# Altium schematic sheet 17_网口接口.schdoc.schdoc
size 309 x 223 mm; Symbol: Sheet-Symbol_A4; Device: Sheet-Symbol_A4; Company: 嘉立创EDA; Version: V1.0; Page Size: A4; @Project Name: RK3568底板_V1.2; @Page Count: 6; @Update Date: 2024-05-10; @Create Date: 2024-04-18; @Schematic Name: 原理图; @Page No: 5; @Page Name: 网口接口
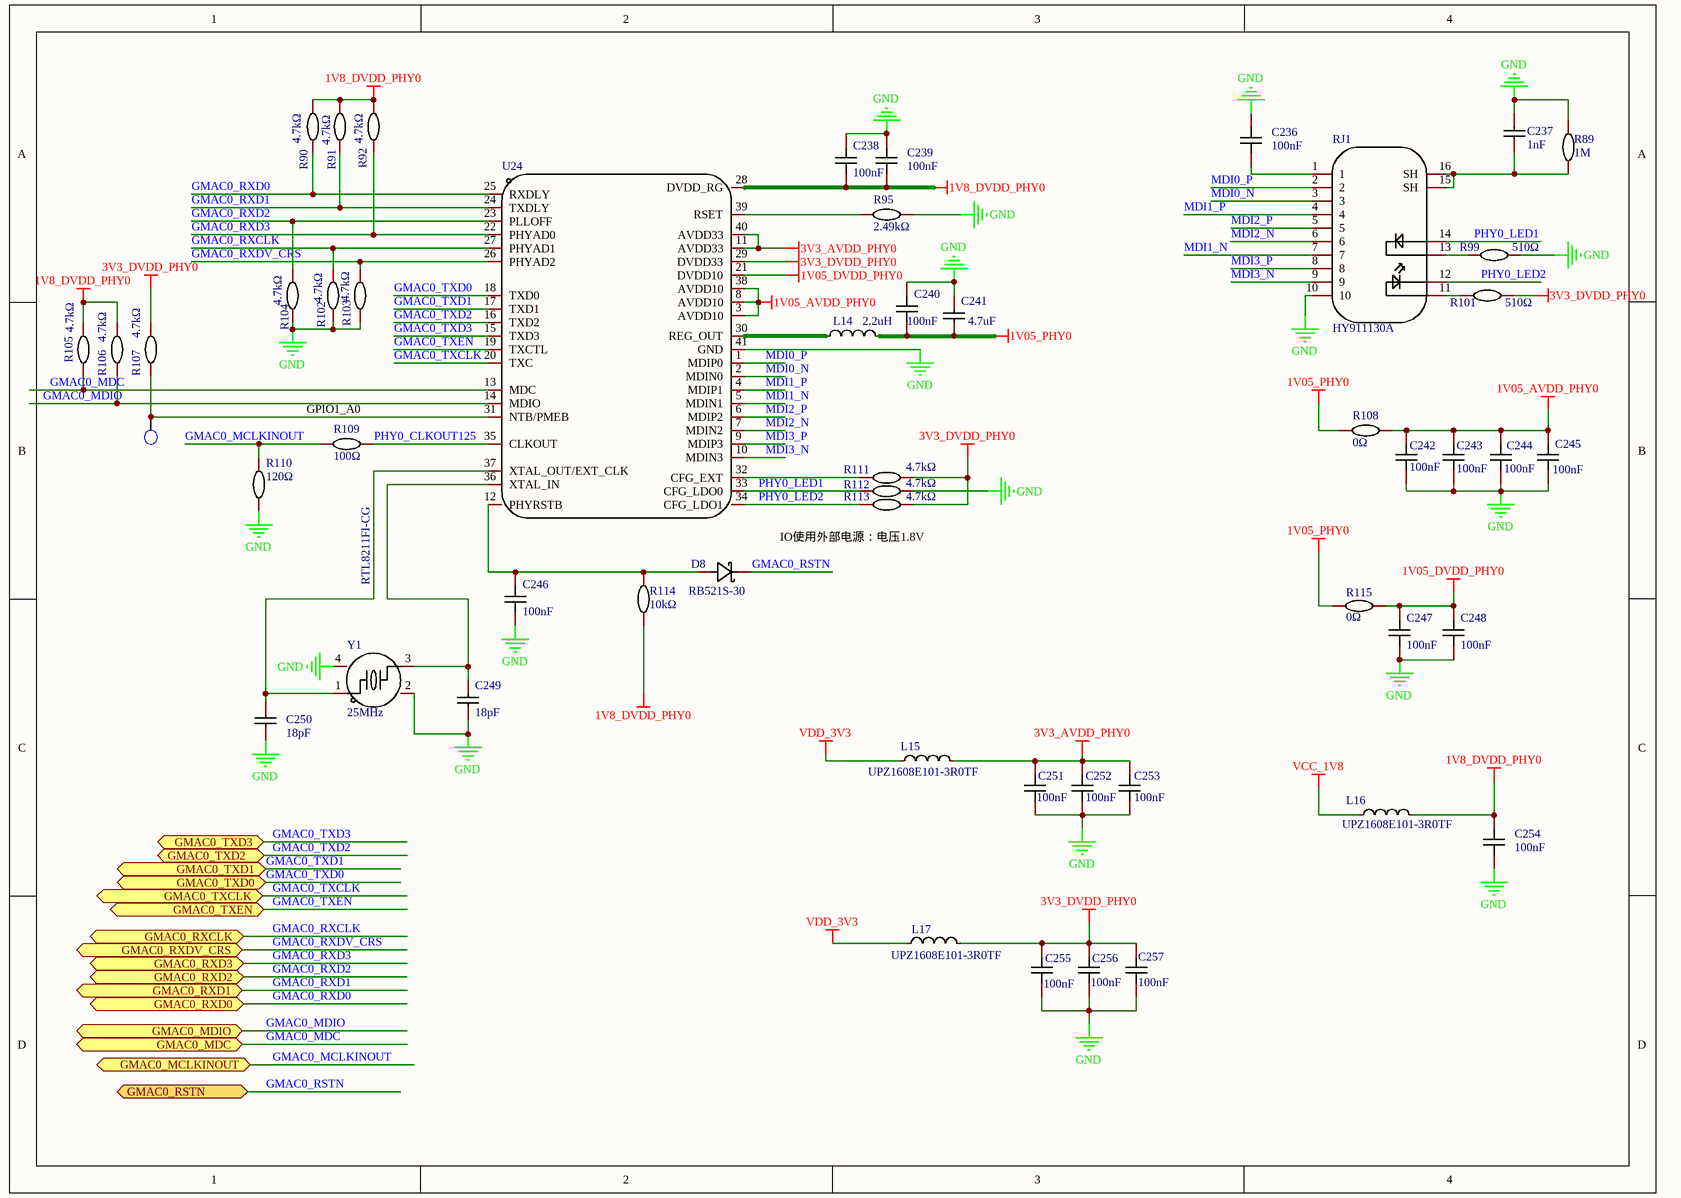
[diagram p0: 17_网口接口.schdoc.schdoc]

## Parts
C236  100nF  [C0603]
C237  1nF  [C0603]
C238  100nF  [C0603]
C239  100nF  [C0603]
C240  100nF  [C0603]
C241  4.7uF  [C0603]
C242  100nF  [C0603]
C243  100nF  [C0603]
C244  100nF  [C0603]
C245  100nF  [C0603]
C246  100nF  [C0603]
C247  100nF  [C0603]
C248  100nF  [C0603]
C249  18pF  [C0603]
C250  18pF  [C0603]
C251  100nF  [C0603]
C252  100nF  [C0603]
C253  100nF  [C0603]
C254  100nF  [C0603]
C255  100nF  [C0603]
C256  100nF  [C0603]
C257  100nF  [C0603]
D8  RB521S-30  [SOD-523_L1.2-W0.8-LS1.6-RD]
L14  2.2uH  [IND-SMD_L2.5-W2.0-VLS252012CX-150M]
L15  UPZ1608E101-3R0TF  [L0603]
L16  UPZ1608E101-3R0TF  [L0603]
L17  UPZ1608E101-3R0TF  [L0603]
R89  1M  [R0805]
R90  4.7kΩ  [R0603]
R91  4.7kΩ  [R0603]
R92  4.7kΩ  [R0603]
R95  2.49kΩ  [R0603]
R99  510Ω  [R0603]
R101  510Ω  [R0603]
R102  4.7kΩ  [R0603]
R103  4.7kΩ  [R0603]
R104  4.7kΩ  [R0603]
R105  4.7kΩ  [R0603]
R106  4.7kΩ  [R0603]
R107  4.7kΩ  [R0603]
R108  0Ω  [R0603]
R109  100Ω  [R0603]
R110  120Ω  [R0603]
R111  4.7kΩ  [R0603]
R112  4.7kΩ  [R0603]
R113  4.7kΩ  [R0603]
R114  10kΩ  [R0603]
R115  0Ω  [R0603]
RJ1  HY911130A  [RJ45-TH_10P-P2.54-S2.54_L16.1-W21.4_HY911130A]
TP1  TP  [TP_0R70]  (value not drawn)
U24  RTL8211FI-CG  [QFN-40_L5.0-W5.0-P0.40-BL-EP3.7]
Y1  25MHz  [CRYSTAL-SMD_4P-L3.2-W2.5-BL]

## Ports
GMAC0_MCLKINOUT (bidir), GMAC0_MDC (bidir), GMAC0_MDIO (bidir), GMAC0_RSTN (bidir), GMAC0_RXCLK (bidir), GMAC0_RXD0 (bidir), GMAC0_RXD1 (bidir), GMAC0_RXD2 (bidir), GMAC0_RXD3 (bidir), GMAC0_RXDV_CRS (bidir), GMAC0_TXCLK (bidir), GMAC0_TXD0 (bidir), GMAC0_TXD1 (bidir), GMAC0_TXD2 (bidir), GMAC0_TXD3 (bidir), GMAC0_TXEN (bidir)

## Nets
1V05_AVDD_PHY0: C242.2 C243.2 C244.2 C245.2 R108.2 U24.3(AVDD10) U24.8(AVDD10) U24.38(AVDD10)
1V05_DVDD_PHY0: C247.2 C248.2 R115.1 U24.21(DVDD10)
1V05_PHY0: C240.1 C241.1 L14.2 R108.1 R115.2
1V8_DVDD_PHY0: C238.1 C239.1 C254.2 L16.1 R90.2 R91.2 R92.2 R105.2 R106.2 R114.2 U24.28(DVDD_RG)
3V3_AVDD_PHY0: C251.2 C252.2 C253.2 L15.1 U24.11(AVDD33) U24.40(AVDD33)
3V3_DVDD_PHY0: C255.2 C256.2 C257.2 L17.1 R101.2 R107.2 R111.2 R113.2 U24.29(DVDD33)
GND: C236.2 C237.1 C238.2 C239.2 C240.2 C241.2 C242.1 C243.1 C244.1 C245.1 C246.1 C247.1 C248.1 C249.2 C250.2 C251.1 C252.1 C253.1 C254.1 C255.1 C256.1 C257.1 R89.1 R95.2 R99.2 R102.1 R103.1 R104.1 R110.1 R112.2 RJ1.10 U24.41(GND) Y1.2(GND) Y1.4(GND)
VCC_1V8: L16.2
VDD_3V3: L15.2 L17.2
GMAC0_MCLKINOUT: R109.1 R110.2 ; port GMAC0_MCLKINOUT
GMAC0_MDC: R105.1 U24.13(MDC) ; port GMAC0_MDC
GMAC0_MDIO: R106.1 U24.14(MDIO) ; port GMAC0_MDIO
GMAC0_RSTN: D8.1(K) ; port GMAC0_RSTN
GMAC0_RXCLK: R102.2 U24.27(PHYAD1) ; port GMAC0_RXCLK
GMAC0_RXD0: R90.1 U24.25(RXDLY) ; port GMAC0_RXD0
GMAC0_RXD1: R91.1 U24.24(TXDLY) ; port GMAC0_RXD1
GMAC0_RXD2: R104.2 U24.23(PLLOFF) ; port GMAC0_RXD2
GMAC0_RXD3: R92.1 U24.22(PHYAD0) ; port GMAC0_RXD3
GMAC0_RXDV_CRS: R103.2 U24.26(PHYAD2) ; port GMAC0_RXDV_CRS
GMAC0_TXCLK: U24.20(TXC) ; port GMAC0_TXCLK
GMAC0_TXD0: U24.18(TXD0) ; port GMAC0_TXD0
GMAC0_TXD1: U24.17(TXD1) ; port GMAC0_TXD1
GMAC0_TXD2: U24.16(TXD2) ; port GMAC0_TXD2
GMAC0_TXD3: U24.15(TXD3) ; port GMAC0_TXD3
GMAC0_TXEN: U24.19(TXCTL) ; port GMAC0_TXEN
MDI0_N: RJ1.3 U24.2(MDIN0)
MDI0_P: RJ1.2 U24.1(MDIP0)
MDI1_N: RJ1.7 U24.5(MDIN1)
MDI1_P: RJ1.4 U24.4(MDIP1)
MDI2_N: RJ1.6 U24.7(MDIN2)
MDI2_P: RJ1.5 U24.6(MDIP2)
MDI3_N: RJ1.9 U24.10(MDIN3)
MDI3_P: RJ1.8 U24.9(MDIP3)
PHY0_CLKOUT125: R109.2 U24.35(CLKOUT)
PHY0_LED1: R112.1 RJ1.14 U24.33(CFG_LDO0)
PHY0_LED2: R113.1 RJ1.12 U24.34(CFG_LDO1)
NetC236_1: C236.1 RJ1.1
NetC237_2: C237.2 R89.2 RJ1.15(SH) RJ1.16(SH)
NetC246_2: C246.2 D8.2(A) R114.1 U24.12(PHYRSTB)
NetC249_1: C249.1 U24.36(XTAL_IN) Y1.3
NetC250_1: C250.1 U24.37(XTAL_OUT/EXT_CLK) Y1.1
NetL14_1: L14.1 U24.30(REG_OUT)
NetR95_1: R95.1 U24.39(RSET)
NetR99_1: R99.1 RJ1.13
NetR101_1: R101.1 RJ1.11
NetR107_1: R107.1 TP1.1 U24.31(NTB/PMEB)
NetR111_1: R111.1 U24.32(CFG_EXT)

## Notes on the sheet
- (near R109) GPIO1_A0
- IO使用外部电源：电压1.8V
- 1
- 2
- 3
- 4
- 5
- 6
- A
- B
- C
- 原理图
- 创建日期
- 更新日期
- 2024-05-10
- 2024-04-18
- 审阅
- 绘制
- 图页
- 网口接口
- 物料编码
- RK3568底板_V1.2
- D
- 版本
- 尺寸
- 页
- 共
- V1.0
- A4
- 嘉立创EDA

## Library data of the parts
C236 C238-C240 C242-C248 C251-C257 = CC0603KRX7R9BB104: Manufacturer: YAGEO(国巨); Add into BOM: yes; Tolerance: ±10%; Voltage Rated: 50V; Temperature Coefficient: X7R; Name: 100nF; Symbol: CC0603KRX7R9BB104; Device: CC0603KRX7R9BB104; Supplier: LCSC; Manufacturer Part: CC0603KRX7R9BB104; Value: 100nF; Supplier Part: C14663; JLCPCB Part Class: 基础库; LCSC Part Name: 100nF ±10% 50V; Supplier Footprint: 0603; Datasheet: https://atta.szlcsc.com/upload/public/pdf/source/20180910/C282072_33301C7F631E79921B82A8DAC6BCC5B3.pdf; Convert to PCB: yes
C237 = CC0603KRX7R9BB102: Manufacturer: YAGEO(国巨); Add into BOM: yes; Tolerance: ±10%; Voltage Rated: 50V; Temperature Coefficient: X7R; Name: 1nF; Symbol: CC0603KRX7R9BB102; Device: CC0603KRX7R9BB102; Supplier: LCSC; Manufacturer Part: CC0603KRX7R9BB102; Value: 1nF; Supplier Part: C100040; JLCPCB Part Class: 扩展库; LCSC Part Name: 1nF ±10% 50V; Supplier Footprint: 0603; Datasheet: https://atta.szlcsc.com/upload/public/pdf/source/20180910/C282072_33301C7F631E79921B82A8DAC6BCC5B3.pdf; Convert to PCB: yes
C241 = CL10A475KO8NNNC: Manufacturer: SAMSUNG(三星); Add into BOM: yes; Tolerance: ±10%; Voltage Rated: 16V; Temperature Coefficient: X5R; Name: 4.7uF; Symbol: CL10A475KO8NNNC; Device: CL10A475KO8NNNC; Supplier: LCSC; Manufacturer Part: CL10A475KO8NNNC; Value: 4.7uF; Supplier Part: C19666; JLCPCB Part Class: 基础库; LCSC Part Name: 4.7uF ±10% 16V; Supplier Footprint: 0603; Datasheet: https://atta.szlcsc.com/upload/public/pdf/source/20160218/1457707763339.pdf; Convert to PCB: yes
C249 C250 = CL10C180JB8NNNC: Manufacturer: SAMSUNG(三星); Add into BOM: yes; Tolerance: ±5%; Voltage Rated: 50V; Temperature Coefficient: C0G; Name: 18pF; Symbol: CL10C180JB8NNNC; Device: CL10C180JB8NNNC; LCSC Part Name: 18pF ±5% 50V; Supplier Part: C1647; Manufacturer Part: CL10C180JB8NNNC; Supplier Footprint: 0603; JLCPCB Part Class: 基础库; Datasheet: https://atta.szlcsc.com/upload/public/pdf/source/20160218/1457707763339.pdf; Supplier: LCSC; Convert to PCB: yes; Value: 18pF
D8 = RB521S-30_C727120: Manufacturer: TWGMC(台湾迪嘉); Add into BOM: yes; Diode Configuration: 独立式; Forward Voltage (Vf@If): 500mV@200mA; Reverse Voltage (Vr): 30V; Average Rectified Current (Io): 200mA; Reverse Leakage Current (Ir): 30uA@10V; Name: RB521S-30; Symbol: RB521S-30_C727120; Device: RB521S-30_C727120; Supplier: LCSC; Supplier Part: C727120; Manufacturer Part: RB521S-30; JLCPCB Part Class: 扩展库; LCSC Part Name: 电压:30V 电流:200mA; Supplier Footprint: SOD-523; Datasheet: https://atta.szlcsc.com/upload/public/pdf/source/20200828/C727120_3E9BC491271A3437FD0D1FDCF4FF716C.pdf; Convert to PCB: yes
L14 = FXLB252012-2R2-M: Manufacturer: cjiang(长江微电); Add into BOM: yes; Tolerance: ±20%; Rated Current: 3A; Saturation Current (Isat): 3.3A; DC Resistance (DCR): 68mΩ; Type: 一体成型电感; Name: 2.2uH; Symbol: FXLB252012-2R2-M; Device: FXLB252012-2R2-M; LCSC Part Name: 2.2uH ±20% 3.3A; Supplier Part: C3040393; Manufacturer Part: FXLB252012-2R2-M; Supplier Footprint: SMD,2.5x2.0x1.2mm; JLCPCB Part Class: 扩展库; Datasheet: https://atta.szlcsc.com/upload/public/pdf/source/20220812/975CD70F8F8BB72DF45FA36D37878048.pdf; Supplier: LCSC; Convert to PCB: yes; Value: 2.2uH; Ratings: AEC-Q200
L15-L17 = UPZ1608E101-3R0TF: Manufacturer: Sunlord(顺络); Add into BOM: yes; Impedance @ Frequency: 100Ω@100MHz; Tolerance: ±25%; DC Resistance: 30mΩ; Current Rating: 3A; Circuits: 1; Name: UPZ1608E101-3R0TF; Symbol: UPZ1608E101-3R0TF; Device: UPZ1608E101-3R0TF; LCSC Part Name: 单路 0603磁珠 阻抗100Ω@100MHz; Supplier Part: C96995; Manufacturer Part: UPZ1608E101-3R0TF; Supplier Footprint: 0603; JLCPCB Part Class: 扩展库; Datasheet: https://atta.szlcsc.com/upload/public/pdf/source/20231030/6F67BDFA94A48EA93F9ABB358D1D978C.pdf; Supplier: LCSC; Convert to PCB: yes
R89 = Res_0805: Symbol: 电阻; Convert to PCB: yes; Name: 1M; Device: Res_0805; Add into BOM: yes; Supplier Footprint: 0805; Value: 1M
R90-R92 R102-R107 R111-R113 = 0603WAF4701T5E: Manufacturer: UNI-ROYAL(厚声); Add into BOM: yes; Tolerance: ±1%; Power(Watts): 100mW; Overload Voltage (Max): 75V; Temperature Coefficient: ±100ppm/℃; Name: 4.7kΩ; Symbol: 0603WAF4701T5E; Device: 0603WAF4701T5E; Supplier: LCSC; Manufacturer Part: 0603WAF4701T5E; Supplier Part: C23162; Value: 4.7kΩ; JLCPCB Part Class: 基础库; LCSC Part Name: 4.7kΩ ±1% 100mW 厚膜电阻; Supplier Footprint: 0603; Datasheet: https://atta.szlcsc.com/upload/public/pdf/source/20200306/C422600_1E6D84923E4A46A82E41ADD87F860B5C.pdf; Convert to PCB: yes; Type: 厚膜电阻; Operating Temperature Range: -55℃~+155℃
R95 = 0603WAF2491T5E: Manufacturer: UNI-ROYAL(厚声); Add into BOM: yes; Tolerance: ±1%; Power(Watts): 100mW; Overload Voltage (Max): 75V; Temperature Coefficient: ±100ppm/℃; Name: 2.49kΩ; Symbol: 0603WAF2491T5E; Device: 0603WAF2491T5E; Supplier: LCSC; Manufacturer Part: 0603WAF2491T5E; Supplier Part: C22908; Value: 2.49kΩ; JLCPCB Part Class: 扩展库; LCSC Part Name: 2.49kΩ ±1% 100mW 厚膜电阻; Supplier Footprint: 0603; Datasheet: https://atta.szlcsc.com/upload/public/pdf/source/20200306/C422600_1E6D84923E4A46A82E41ADD87F860B5C.pdf; Convert to PCB: yes; Type: 厚膜电阻; Operating Temperature Range: -55℃~+155℃
R99 R101 = 0603WAF5100T5E: Manufacturer: UNI-ROYAL(厚声); Add into BOM: yes; Tolerance: ±1%; Power(Watts): 100mW; Overload Voltage (Max): 75V; Temperature Coefficient: ±100ppm/℃; Name: 510Ω; Symbol: 0603WAF5100T5E; Device: 0603WAF5100T5E; Supplier: LCSC; Manufacturer Part: 0603WAF5100T5E; Supplier Part: C23193; Value: 510Ω; JLCPCB Part Class: 基础库; LCSC Part Name: 510Ω ±1% 100mW 厚膜电阻; Supplier Footprint: 0603; Datasheet: https://atta.szlcsc.com/upload/public/pdf/source/20200306/C422600_1E6D84923E4A46A82E41ADD87F860B5C.pdf; Convert to PCB: yes; Type: 厚膜电阻; Operating Temperature Range: -55℃~+155℃
R108 R115 = 0603WAF0000T5E: Manufacturer: UNI-ROYAL(厚声); Add into BOM: yes; Tolerance: ±1%; Power(Watts): 100mW; Overload Voltage (Max): 75V; Name: 0Ω; Symbol: 0603WAF0000T5E; Device: 0603WAF0000T5E; Supplier: LCSC; Manufacturer Part: 0603WAF0000T5E; Supplier Part: C21189; Value: 0Ω; JLCPCB Part Class: 基础库; LCSC Part Name: 0Ω ±1% 100mW 厚膜电阻; Supplier Footprint: 0603; Datasheet: https://atta.szlcsc.com/upload/public/pdf/source/20200306/C422600_1E6D84923E4A46A82E41ADD87F860B5C.pdf; Convert to PCB: yes; Type: 厚膜电阻; Operating Temperature Range: -55℃~+155℃
R109 = 0603WAF1000T5E: Manufacturer: UNI-ROYAL(厚声); Add into BOM: yes; Tolerance: ±1%; Power(Watts): 100mW; Overload Voltage (Max): 75V; Temperature Coefficient: ±200ppm/℃; Name: 100Ω; Symbol: 0603WAF1000T5E; Device: 0603WAF1000T5E; LCSC Part Name: 100Ω ±1% 100mW 厚膜电阻; Supplier Part: C22775; Manufacturer Part: 0603WAF1000T5E; Supplier Footprint: 0603; JLCPCB Part Class: 基础库; Datasheet: https://atta.szlcsc.com/upload/public/pdf/source/20200306/C422600_1E6D84923E4A46A82E41ADD87F860B5C.pdf; Supplier: LCSC; Convert to PCB: yes; Type: 厚膜电阻; Value: 100Ω; Operating Temperature Range: -55℃~+155℃
R110 = 0603WAF1200T5E: Manufacturer: UNI-ROYAL(厚声); Add into BOM: yes; Tolerance: ±1%; Power(Watts): 100mW; Overload Voltage (Max): 75V; Temperature Coefficient: ±100ppm/℃; Name: 120Ω; Symbol: 0603WAF1200T5E; Device: 0603WAF1200T5E; Supplier: LCSC; Manufacturer Part: 0603WAF1200T5E; Supplier Part: C22787; Value: 120Ω; JLCPCB Part Class: 基础库; LCSC Part Name: 120Ω ±1% 100mW 厚膜电阻; Supplier Footprint: 0603; Datasheet: https://atta.szlcsc.com/upload/public/pdf/source/20200306/C422600_1E6D84923E4A46A82E41ADD87F860B5C.pdf; Convert to PCB: yes; Type: 厚膜电阻; Operating Temperature Range: -55℃~+155℃
R114 = 0603WAF1002T5E: Manufacturer: UNI-ROYAL(厚声); Add into BOM: yes; Tolerance: ±1%; Power(Watts): 100mW; Overload Voltage (Max): 75V; Temperature Coefficient: ±100ppm/℃; Name: 10kΩ; Symbol: 0603WAF1002T5E; Device: 0603WAF1002T5E; Supplier: LCSC; Manufacturer Part: 0603WAF1002T5E; Supplier Part: C25804; Value: 10kΩ; JLCPCB Part Class: 基础库; LCSC Part Name: 厚膜电阻 10kΩ ±1% 100mW; Supplier Footprint: 0603; Datasheet: https://atta.szlcsc.com/upload/public/pdf/source/20200306/C422600_1E6D84923E4A46A82E41ADD87F860B5C.pdf; Convert to PCB: yes; Type: 厚膜电阻; Operating Temperature Range: -55℃~+155℃
RJ1 = HY911130A: Manufacturer: HANRUN(汉仁); Add into BOM: yes; Connector Type: RJ插座; USOC Codes: RJ45; Number of Ports: 1; Shielding: 有屏蔽; LED: 带LED; Name: HY911130A; Symbol: HY911130A; Device: HY911130A; Supplier: LCSC; Manufacturer Part: HY911130A; Supplier Part: C55679; JLCPCB Part Class: 扩展库; LCSC Part Name: RJ45 带LED; Supplier Footprint: 插件; Datasheet: https://atta.szlcsc.com/upload/public/pdf/source/20151014/1457707458663.pdf; Convert to PCB: yes; Ratings: -
U24 = RTL8211FI-CG: Manufacturer: REALTEK(瑞昱); Add into BOM: yes; Name: RTL8211FI-CG; Symbol: RTL8211FI-CG; Device: RTL8211FI-CG; LCSC Part Name: 集成10/100/1000M以太网精密收发器; Supplier Part: C717681; Manufacturer Part: RTL8211FI-CG; Supplier Footprint: QFN-40-EP(5x5); JLCPCB Part Class: 扩展库; Datasheet: https://atta.szlcsc.com/upload/public/pdf/source/20230811/F5B2BED88AB5EA25EC708468CC105183.pdf; Supplier: LCSC; Convert to PCB: yes
Y1 = XL2EL89CSI-111YLC-25M: Manufacturer: YXC(扬兴晶振); Add into BOM: yes; Crystal Type: 贴片晶振; Normal temperature Frequency Tolerance: ±10ppm; External load capacitor: 20pF; Name: 25MHz; Symbol: XL2EL89CSI-111YLC-25M; Device: XL2EL89CSI-111YLC-25M; Supplier: LCSC; Supplier Part: C5280577; Manufacturer Part: XL2EL89CSI-111YLC-25M; Value: 25MHz; JLCPCB Part Class: 扩展库; LCSC Part Name: 25MHz ±10ppm 20pF YSX321SL; Supplier Footprint: SMD3225-4P; Datasheet: https://atta.szlcsc.com/upload/public/pdf/source/20221123/8DAA01809C4E3F159850A71277C18D74.pdf; Convert to PCB: yes